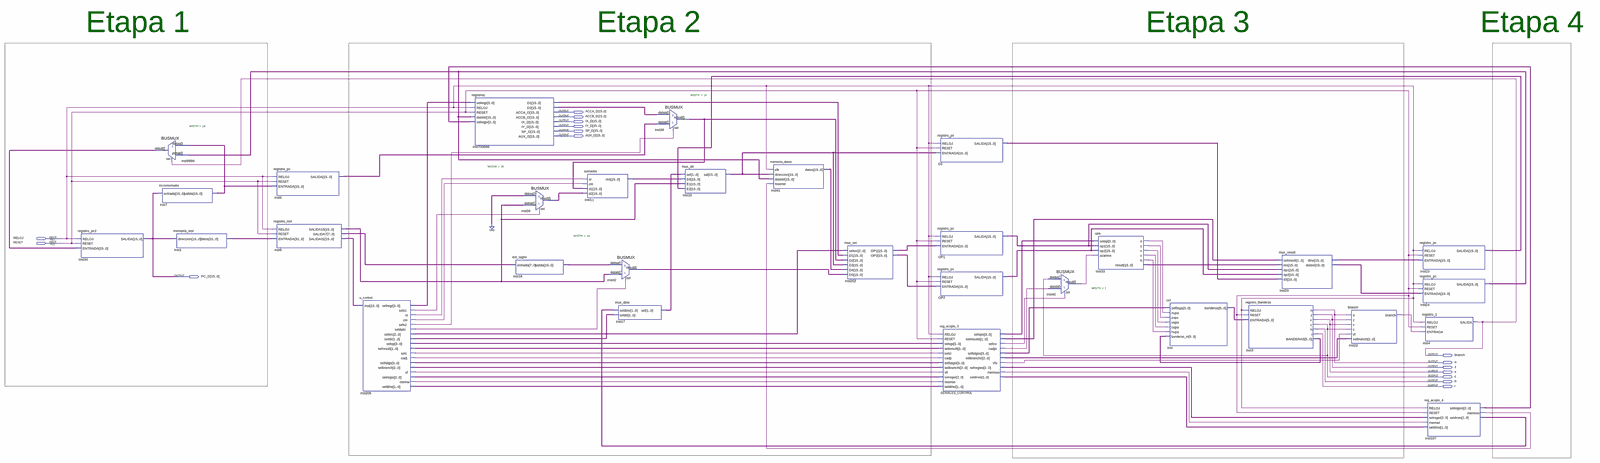
[diagram p0: schematic sheet, whole]
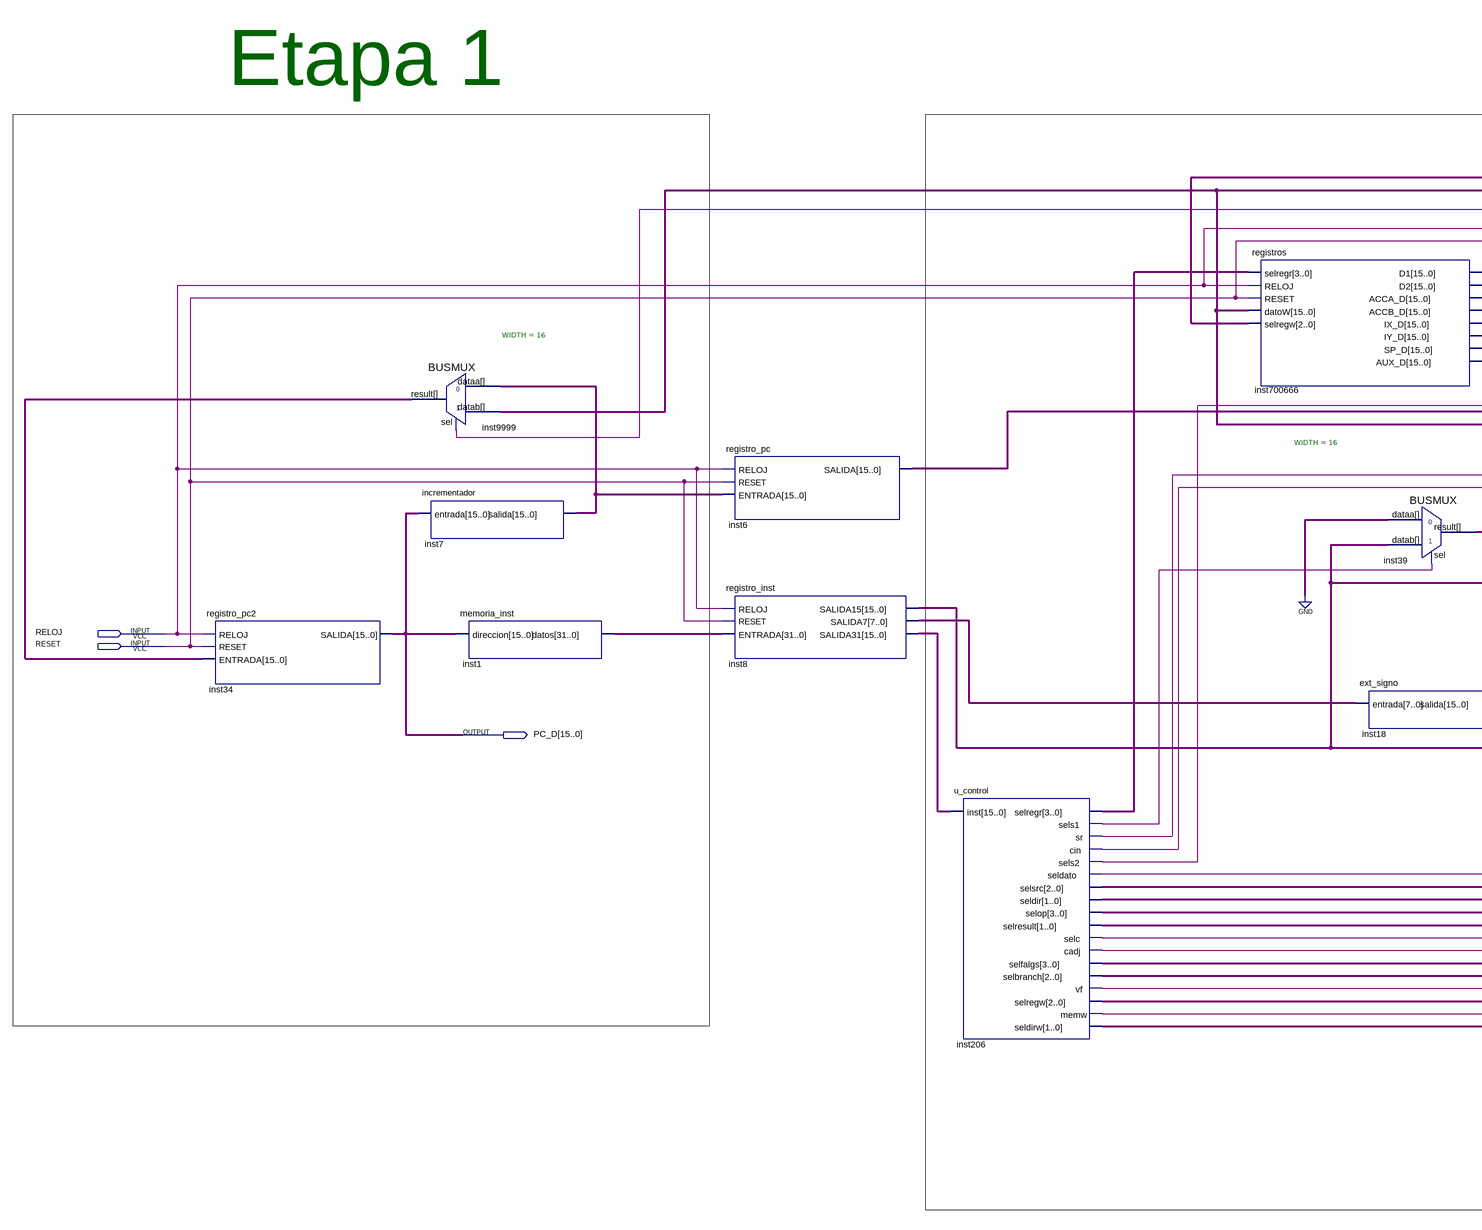
[diagram p1: schematic sheet, left part]
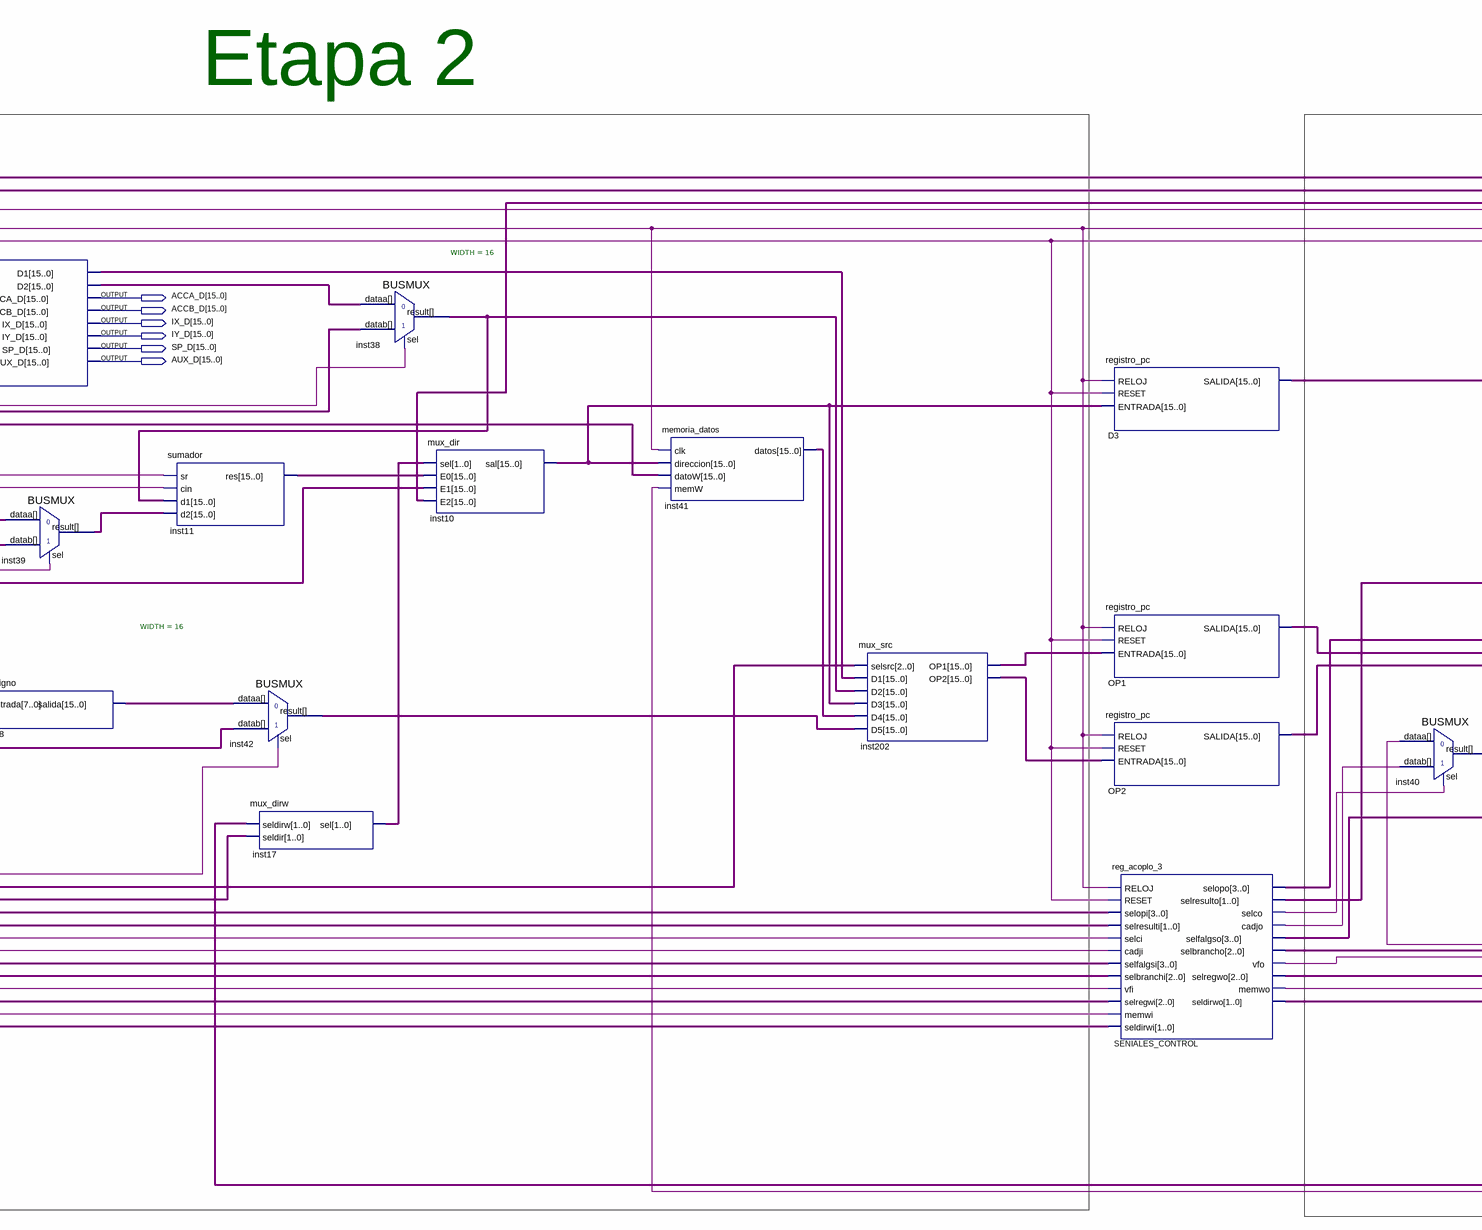
[diagram p2: schematic sheet, centre part]
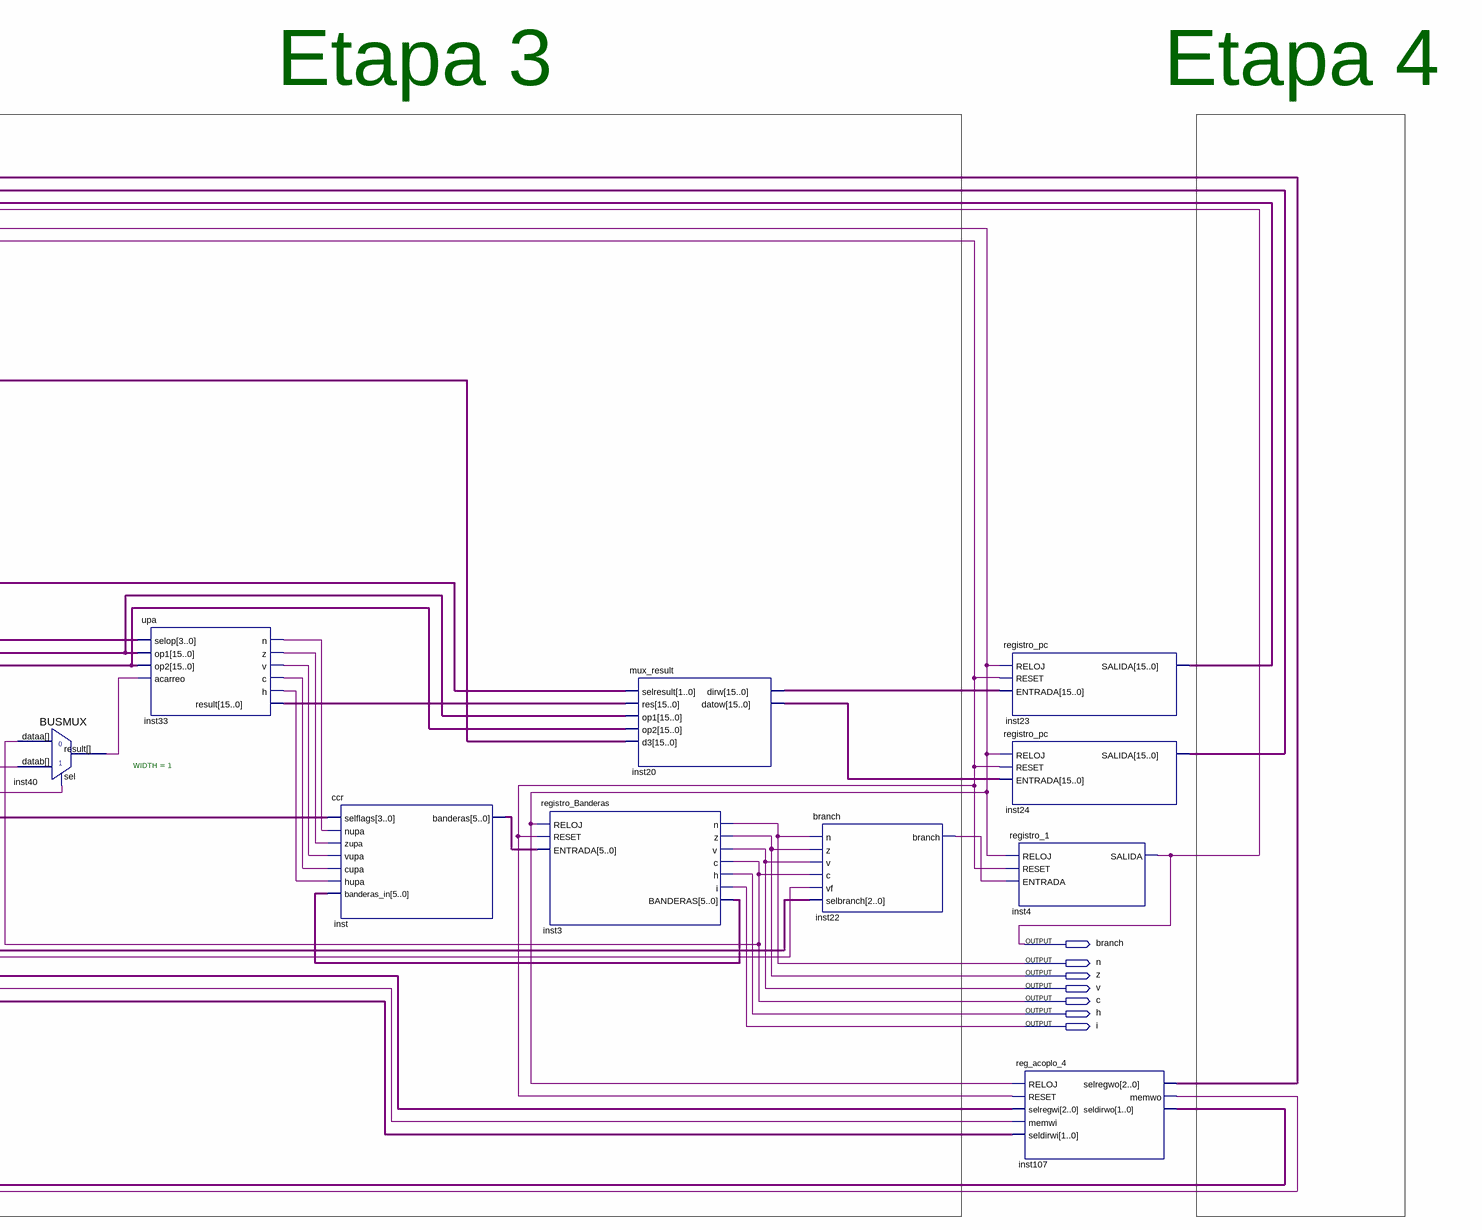
[diagram p3: schematic sheet, right part]
// Quartus schematic pipeline.bdf as structural Verilog: 31 symbols, 16 pins
module pipeline (
  input  RELOJ,
  input  RESET,
  output [15:0] ACCA_D,
  output [15:0] ACCB_D,
  output [15:0] IX_D,
  output [15:0] IY_D,
  output [15:0] SP_D,
  output [15:0] AUX_D,
  output [15:0] PC_D,
  output branch,
  output n,
  output z,
  output v,
  output c,
  output h,
  output i
);

  wire inst22_branch, inst33_c, inst33_h, inst33_n, inst33_v, inst33_z, inst40_result, inst107_memwo,
       inst206_cadj, inst206_cin, inst206_memw, inst206_selc, inst206_seldato, inst206_sels1, inst206_sels2,
       inst206_sr, inst206_vf, SENIALES_CONTROL_cadjo, SENIALES_CONTROL_memwo, SENIALES_CONTROL_selco,
       SENIALES_CONTROL_vfo;
  wire [1:0] inst17_sel, inst107_seldirwo, inst206_seldir, inst206_seldirw, inst206_selresult,
       SENIALES_CONTROL_seldirwo, SENIALES_CONTROL_selresulto;
  wire [2:0] inst107_selregwo, inst206_selbranch, inst206_selregw, inst206_selsrc,
       SENIALES_CONTROL_selbrancho, SENIALES_CONTROL_selregwo;
  wire [3:0] inst206_selfalgs, inst206_selop, inst206_selregr, SENIALES_CONTROL_selfalgso,
       SENIALES_CONTROL_selopo;
  wire [5:0] inst3_banderas, inst_banderas;
  wire [7:0] inst8_salida7;
  wire [15:0] D3_salida, inst6_salida, inst7_salida, inst8_salida15, inst8_salida31, inst10_sal, inst11_res,
       inst18_salida, inst20_datow, inst20_dirw, inst23_salida, inst24_salida, inst33_result, inst38_result,
       inst39_result, inst41_datos, inst42_result, inst202_op1, inst202_op2, inst9999_result, inst700666_d1,
       inst700666_d2, OP1_salida, OP2_salida;
  wire [31:0] inst1_datos;

  registro_pc2 inst34 (.RELOJ(RELOJ), .RESET(RESET), .ENTRADA(inst9999_result), .SALIDA(PC_D));
  BUSMUX #(.WIDTH(16)) inst9999 (.datab(inst24_salida), .sel(branch), .dataa(inst7_salida), .result(inst9999_result));
  incrementador inst7 (.entrada(PC_D), .salida(inst7_salida));
  memoria_inst inst1 (.direccion(PC_D), .datos(inst1_datos));
  registro_pc inst6 (.RELOJ(RELOJ), .RESET(RESET), .ENTRADA(inst7_salida), .SALIDA(inst6_salida));
  registro_inst inst8 (
    .RELOJ(RELOJ), .RESET(RESET), .ENTRADA(inst1_datos), .SALIDA15(inst8_salida15), .SALIDA7(inst8_salida7),
    .SALIDA31(inst8_salida31));
  u_control inst206 (
    .inst(inst8_salida31), .selregr(inst206_selregr), .sels1(inst206_sels1), .sr(inst206_sr),
    .cin(inst206_cin), .sels2(inst206_sels2), .seldato(inst206_seldato), .selsrc(inst206_selsrc),
    .seldir(inst206_seldir), .selop(inst206_selop), .selresult(inst206_selresult), .selc(inst206_selc),
    .cadj(inst206_cadj), .selfalgs(inst206_selfalgs), .selbranch(inst206_selbranch), .vf(inst206_vf),
    .selregw(inst206_selregw), .memw(inst206_memw), .seldirw(inst206_seldirw));
  registros inst700666 (
    .selregr(inst206_selregr), .RELOJ(RELOJ), .RESET(RESET), .datoW(inst24_salida),
    .selregw(inst107_selregwo), .D1(inst700666_d1), .D2(inst700666_d2), .ACCA_D(ACCA_D), .ACCB_D(ACCB_D),
    .IX_D(IX_D), .IY_D(IY_D), .SP_D(SP_D), .AUX_D(AUX_D));
  ext_signo inst18 (.entrada(inst8_salida7), .salida(inst18_salida));
  BUSMUX #(.WIDTH(16)) inst39 (.datab(inst8_salida15), .sel(inst206_sels1), .dataa({16{1'b0}}), .result(inst39_result));
  sumador inst11 (.sr(inst206_sr), .cin(inst206_cin), .d1(inst38_result), .d2(inst39_result), .res(inst11_res));
  BUSMUX #(.WIDTH(16)) inst42 (
    .datab(inst8_salida15), .sel(inst206_seldato), .dataa(inst18_salida), .result(inst42_result));
  mux_dirw inst17 (.seldirw(inst107_seldirwo), .seldir(inst206_seldir), .sel(inst17_sel));
  BUSMUX #(.WIDTH(16)) inst38 (
    .datab(inst6_salida), .sel(inst206_sels2), .dataa(inst700666_d2), .result(inst38_result));
  mux_dir inst10 (.sel(inst17_sel), .E0(inst11_res), .E1(inst8_salida15), .E2(inst23_salida), .sal(inst10_sal));
  memoria_datos inst41 (
    .clk(RELOJ), .direccion(inst10_sal), .datoW(inst24_salida), .memW(inst107_memwo), .datos(inst41_datos));
  mux_src inst202 (
    .selsrc(inst206_selsrc), .D1(inst700666_d1), .D2(inst38_result), .D3(inst10_sal), .D4(inst41_datos),
    .D5(inst42_result), .OP1(inst202_op1), .OP2(inst202_op2));
  registro_pc D3 (.RELOJ(RELOJ), .RESET(RESET), .ENTRADA(inst10_sal), .SALIDA(D3_salida));
  registro_pc OP1 (.RELOJ(RELOJ), .RESET(RESET), .ENTRADA(inst202_op1), .SALIDA(OP1_salida));
  registro_pc OP2 (.RELOJ(RELOJ), .RESET(RESET), .ENTRADA(inst202_op2), .SALIDA(OP2_salida));
  reg_acoplo_3 SENIALES_CONTROL (
    .RELOJ(RELOJ), .RESET(RESET), .selopi(inst206_selop), .selresulti(inst206_selresult),
    .selci(inst206_selc), .cadji(inst206_cadj), .selfalgsi(inst206_selfalgs), .selbranchi(inst206_selbranch),
    .vfi(inst206_vf), .selregwi(inst206_selregw), .memwi(inst206_memw), .seldirwi(inst206_seldirw),
    .selopo(SENIALES_CONTROL_selopo), .selresulto(SENIALES_CONTROL_selresulto),
    .selco(SENIALES_CONTROL_selco), .cadjo(SENIALES_CONTROL_cadjo), .selfalgso(SENIALES_CONTROL_selfalgso),
    .selbrancho(SENIALES_CONTROL_selbrancho), .vfo(SENIALES_CONTROL_vfo),
    .selregwo(SENIALES_CONTROL_selregwo), .memwo(SENIALES_CONTROL_memwo), .seldirwo(SENIALES_CONTROL_seldirwo));
  BUSMUX #(.WIDTH(1)) inst40 (
    .datab(SENIALES_CONTROL_cadjo), .sel(SENIALES_CONTROL_selco), .dataa(c), .result(inst40_result));
  upa inst33 (
    .selop(SENIALES_CONTROL_selopo), .op1(OP1_salida), .op2(OP2_salida), .acarreo(inst40_result),
    .n(inst33_n), .z(inst33_z), .v(inst33_v), .c(inst33_c), .h(inst33_h), .result(inst33_result));
  ccr inst (
    .selflags(SENIALES_CONTROL_selfalgso), .nupa(inst33_n), .zupa(inst33_z), .vupa(inst33_v),
    .cupa(inst33_c), .hupa(inst33_h), .banderas_in(inst3_banderas), .banderas(inst_banderas));
  registro_Banderas inst3 (
    .RELOJ(RELOJ), .RESET(RESET), .ENTRADA(inst_banderas), .n(n), .z(z), .v(v), .c(c), .h(h), .i(i),
    .BANDERAS(inst3_banderas));
  mux_result inst20 (
    .selresult(SENIALES_CONTROL_selresulto), .res(inst33_result), .op1(OP1_salida), .op2(OP2_salida),
    .d3(D3_salida), .dirw(inst20_dirw), .datow(inst20_datow));
  branch inst22 (
    .n(n), .z(z), .v(v), .c(c), .vf(SENIALES_CONTROL_vfo), .selbranch(SENIALES_CONTROL_selbrancho),
    .branch(inst22_branch));
  registro_pc inst23 (.RELOJ(RELOJ), .RESET(RESET), .ENTRADA(inst20_dirw), .SALIDA(inst23_salida));
  registro_pc inst24 (.RELOJ(RELOJ), .RESET(RESET), .ENTRADA(inst20_datow), .SALIDA(inst24_salida));
  registro_1 inst4 (.RELOJ(RELOJ), .RESET(RESET), .ENTRADA(inst22_branch), .SALIDA(branch));
  reg_acoplo_4 inst107 (
    .RELOJ(RELOJ), .RESET(RESET), .selregwi(SENIALES_CONTROL_selregwo), .memwi(SENIALES_CONTROL_memwo),
    .seldirwi(SENIALES_CONTROL_seldirwo), .selregwo(inst107_selregwo), .memwo(inst107_memwo),
    .seldirwo(inst107_seldirwo));

  // Notes on the sheet:
  //   Etapa 1
  //   Etapa 2
  //   Etapa 3
  //   Etapa 4
endmodule
